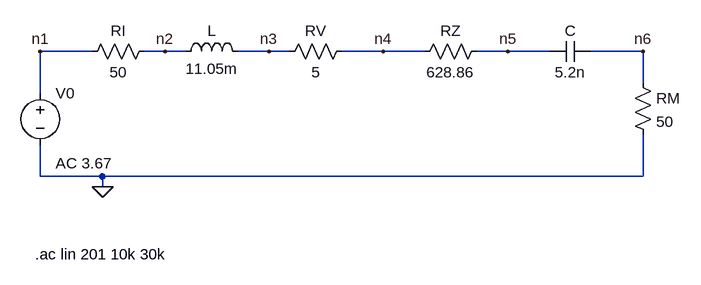
[diagram p0: schematic lab2_prep_2-2_schematic.asc]
lab2_prep_2-2_schematic.asc, the LTspice schematic file:
Version 4
SHEET 1 1004 680
WIRE 96 48 16 48
WIRE 208 48 176 48
WIRE 240 48 208 48
WIRE 368 48 320 48
WIRE 400 48 368 48
WIRE 544 48 480 48
WIRE 608 48 544 48
WIRE 736 48 688 48
WIRE 800 48 736 48
WIRE 944 48 864 48
WIRE 944 96 944 48
WIRE 16 112 16 48
WIRE 16 240 16 192
WIRE 112 240 16 240
WIRE 944 240 944 176
WIRE 944 240 112 240
WIRE 112 256 112 240
FLAG 112 256 0
FLAG 16 48 n1
FLAG 208 48 n2
FLAG 368 48 n3
FLAG 544 48 n4
FLAG 736 48 n5
FLAG 944 48 n6
SYMBOL voltage 16 96 R0
WINDOW 123 24 124 Left 2
WINDOW 39 0 0 Left 0
SYMATTR InstName V0
SYMATTR Value ""
SYMATTR Value2 AC 3.67
SYMBOL res 80 64 R270
WINDOW 0 32 56 VTop 2
WINDOW 3 0 56 VBottom 2
SYMATTR InstName RI
SYMATTR Value 50
SYMBOL ind 224 64 R270
WINDOW 0 32 56 VTop 2
WINDOW 3 5 56 VBottom 2
SYMATTR InstName L
SYMATTR Value 11.05m
SYMBOL res 384 64 R270
WINDOW 0 32 56 VTop 2
WINDOW 3 0 56 VBottom 2
SYMATTR InstName RV
SYMATTR Value 5
SYMBOL res 592 64 R270
WINDOW 0 32 56 VTop 2
WINDOW 3 0 56 VBottom 2
SYMATTR InstName RZ
SYMATTR Value 628.86
SYMBOL cap 800 64 R270
WINDOW 0 32 32 VTop 2
WINDOW 3 0 32 VBottom 2
SYMATTR InstName C
SYMATTR Value 5.2n
SYMBOL res 928 80 R0
SYMATTR InstName RM
SYMATTR Value 50
TEXT 8 360 Left 2 !.ac lin 201 10k 30k

The netlist it stands for:
* lab2_prep_2-2_schematic.asc
V0 n1 0 AC 3.67
RI n1 n2 50
L n2 n3 11.05m
RV n3 n4 5
RZ n4 n5 628.86
C n5 n6 5.2n
RM n6 0 50
.ac lin 201 10k 30k
.backanno
.end